# EAGLE design main (EAGLE 9.6.2)
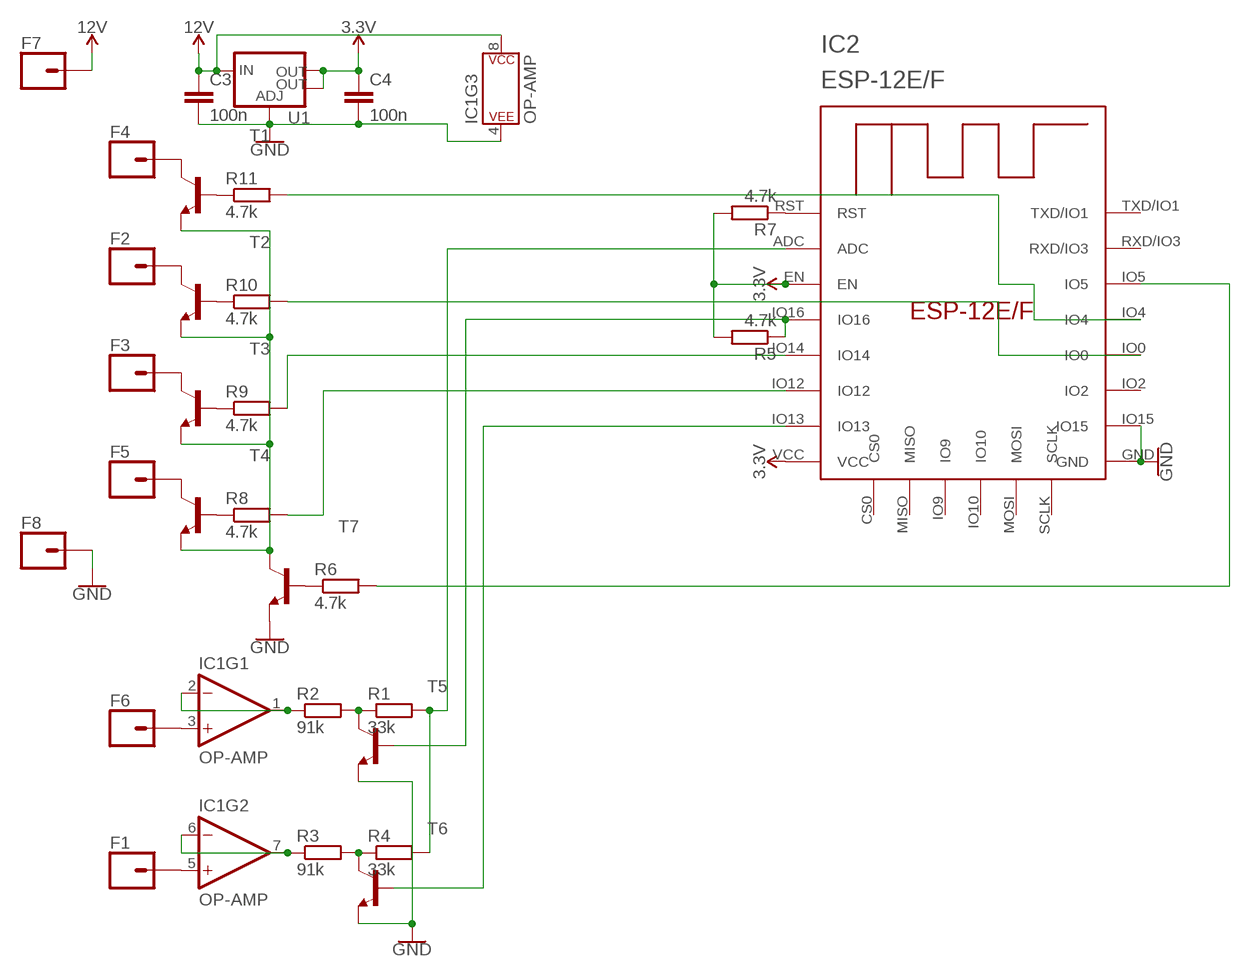
[diagram p0: schematic, sheet 1]

## Parts
C3  100n  C-EUC0805K  [C0805K]
C4  100n  C-EUC0805K  [C0805K]
F1  CONN_01OFFSET  [1X01_OFFSET]
F2  CONN_01OFFSET  [1X01_OFFSET]
F3  CONN_01OFFSET  [1X01_OFFSET]
F4  CONN_01OFFSET  [1X01_OFFSET]
F5  CONN_01OFFSET  [1X01_OFFSET]
F6  CONN_01OFFSET  [1X01_OFFSET]
F7  CONN_01OFFSET  [1X01_OFFSET]
F8  CONN_01OFFSET  [1X01_OFFSET]
IC1  OP-AMP  OPAMP-DUALU  [SO08]
IC2  ESP-12E/F  [ESP-12E]
R1  33k  R-EU_R0805  [R0805]
R2  91k  R-EU_R0805  [R0805]
R3  91k  R-EU_R0805  [R0805]
R4  33k  R-EU_R0805  [R0805]
R5  4.7k  R-EU_R0805  [R0805]
R6  4.7k  R-EU_R0805  [R0805]
R7  4.7k  R-EU_R0805  [R0805]
R8  4.7k  R-EU_R0805  [R0805]
R9  4.7k  R-EU_R0805  [R0805]
R10  4.7k  R-EU_R0805  [R0805]
R11  4.7k  R-EU_R0805  [R0805]
T1  MMBT5551LT1-NPN-SOT23-BEC  [SOT23-BEC]
T2  MMBT5551LT1-NPN-SOT23-BEC  [SOT23-BEC]
T3  MMBT5551LT1-NPN-SOT23-BEC  [SOT23-BEC]
T4  MMBT5551LT1-NPN-SOT23-BEC  [SOT23-BEC]
T5  MMBT5551LT1-NPN-SOT23-BEC  [SOT23-BEC]
T6  MMBT5551LT1-NPN-SOT23-BEC  [SOT23-BEC]
T7  MMBT5551LT1-NPN-SOT23-BEC  [SOT23-BEC]
U1  V_REG_LM1117SOT223  [SOT223]

## Nets
3.3V: C4.1 IC2.EN IC2.VCC R5.2 R7.2 U1.2(OUT) U1.4(OUT)
12V: C3.1 F7.1 IC1.8(P$V+) U1.3(IN)
GND: C3.2 C4.2 F8.1 IC1.4(P$V-) IC2.GND IC2.IO15 T5.E T6.E T7.E U1.1(ADJ)
N$1: F1.1 IC1.5(+IN)
N$2: F4.1 T1.C
N$3: F2.1 T2.C
N$4: F5.1 T4.C
N$5: F3.1 T3.C
N$6: F6.1 IC1.3(+IN)
N$7: T1.E T2.E T3.E T4.E T7.C
N$8: R6.1 T7.B
N$9: IC2.IO0 R10.2
N$10: R1.1 R2.2 T5.C
N$11: IC1.1(OUT) IC1.2(-IN) R2.1
N$12: R3.2 R4.1 T6.C
N$13: IC1.6(-IN) IC1.7(OUT) R3.1
N$14: IC2.ADC R1.2 R4.2
N$15: IC2.IO4 R11.2
N$16: IC2.IO5 R6.2
N$17: R8.1 T4.B
N$18: IC2.IO12 R8.2
N$19: IC2.IO13 T6.B
N$20: IC2.IO16 R5.1 T5.B
N$21: IC2.RST R7.1
N$25: R9.1 T3.B
N$26: R10.1 T2.B
N$27: R11.1 T1.B
N$28: IC2.IO14 R9.2
Unconnected: IC2.CS0 IC2.IO2 IC2.IO9 IC2.IO10 IC2.MISO IC2.MOSI IC2.RXD/IO3 IC2.SCLK IC2.TXD/IO1

## Library data of the parts
C3 C4 = resistor:C-EU: CAPACITOR, European symbol
F1-F8 = SparkFun-Connectors:CONN_01: Single connection point. Often used as Generic Header-pin footprint for 0.1 inch spaced/style header connections On any of the 0.1 inch spaced packages, you can populate with these: Break Away Headers - Straight <https://www.sparkfun.com/products/116> (PRT-00116) Break Away Male Headers - Right Angle <https://www.sparkfun.com/products/553> (PRT-00553) Female Headers <https://www.sparkfun.com/products/115> (PRT-00115) Break Away Headers - Machine Pin <https://www.sparkfun.com/products/117> (PRT-00117) Break Away Female Headers - Swiss Machine Pin <https://www.sparkfun.com/products/743> (PRT-00743) This device is also useful as a general connection point to wire up your design to another part of your project. Our various solder wires solder well into these plated through hole pads. Hook-Up Wire - Assortment (Stranded, 22 AWG) <https://www.sparkfun.com/products/11375> (PRT-11375) Hook-Up Wire - Assortment (Solid Core, 22 AWG) <https://www.sparkfun.com/products/11367> (PRT-11367) View the entire wire category on our website here <https://www.sparkfun.com/categories/141> Special notes: SMTSO-256-ET is a "flush mount" nut for a 4-40 screw. We mostly use this on specialty testbeds; it is a nice way to connect hardware to your PCB at an adjustable hieght. Also note, the SNAP packages are for using a snappable style connector. We sell a baggie of snaps and they are also used on two LilyPad designs: Snap Assortment - 30 pack (male and female) <https://www.sparkfun.com/products/11347> (DEV-11347) LilyPad Arduino SimpleSnap <https://www.sparkfun.com/products/10941> (DEV-10941) LilyPad SimpleSnap Protoboard <https://www.sparkfun.com/products/10940> (DEV-10940)
IC1 = SparkFun-IC-Amplifiers:OPAMP-DUAL: Generic op-amp footprint This component is for the standard 358 pinning of a dual op-amp From the LM358 datasheet: Pin 1: Output A Pin 2: Inverting Input A Pin 3: Non-Inverting Input A Pin 4: Gnd Pin 5: Non-Inverting Input B Pin 6: Inverting Input B Pin 7: Output B Pin 8: V+; PROD_ID: NA-XXXXX
IC2 = esp-12e-f:ESP-12E/F
R1-R11 = resistor:R-EU_: RESISTOR, European symbol
T1-T7 = transistor:*-NPN-: NPN Transistror BF959 corrected 2008.03.06
U1 = SparkFun-IC-Power:V_REG_LM1117: Voltage Regulator LM1117 Standard adjustable voltage regulator but in SMD form. Spark Fun Electronics SKU : COM-00595; PROD_ID: VREG-08170

## Board
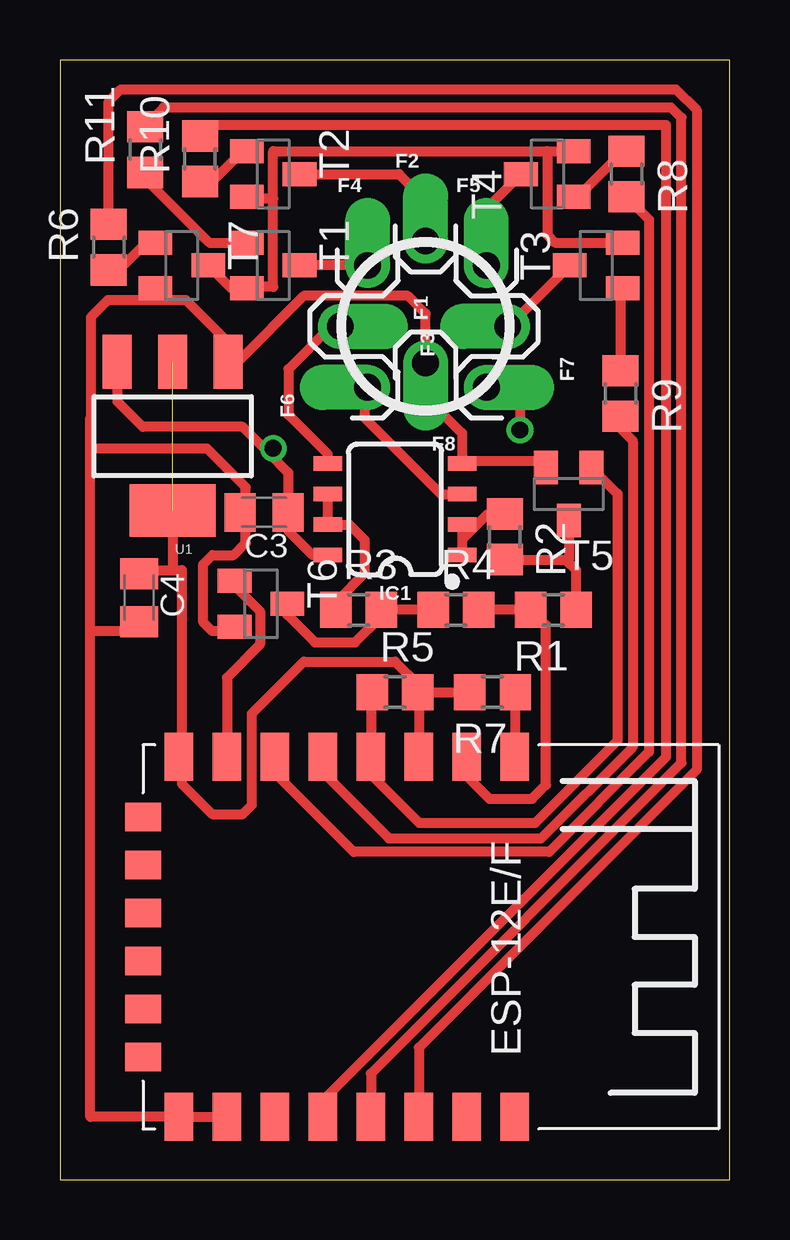
[diagram p1: board, top side]
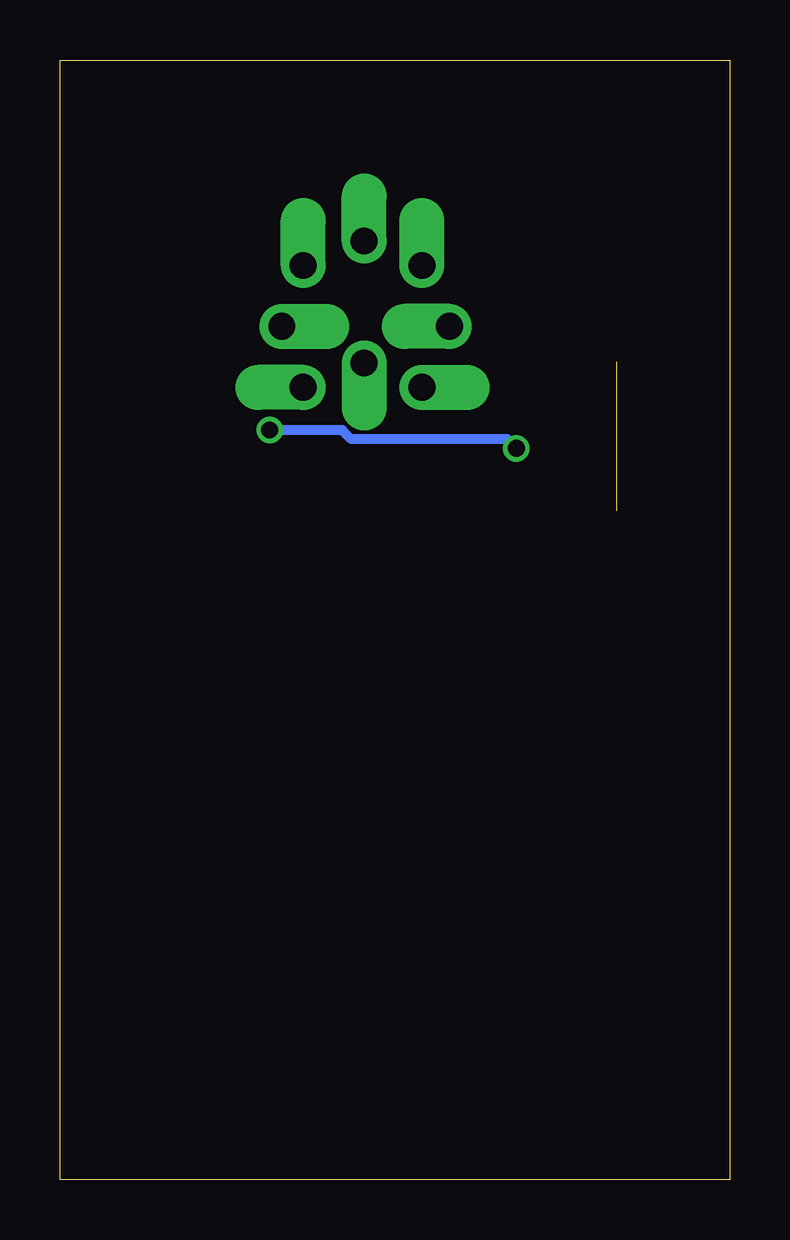
[diagram p2: board, bottom side, seen from below]

Size 27.92 x 46.66 mm. Coordinates in mm from the lower left corner, seen from the top.
Outline: 0,0 27.92,0 27.92,46.66 0,46.66 0,0
Copper layers (1*16): Top 0.035mm / dielectric 1.5mm / Bottom 0.035mm
Design rules "default": minimum track width 6mil, minimum drill 0.35mm, track to track 6mil, track to pad 6mil, pad to pad 6mil, via to via 6mil, smd to smd 6mil, copper to edge 40mil, drill to drill 6mil, minimum pad ring 10mil, minimum via ring 8mil, stop-mask expansion 4mil, vias tented up to drill 0mil, thermal gap 10mil

### Footprints (pad centres in the part's own frame; a part is rotated, then mirrored left to right if it is on the bottom)
C0805K = smd 1.3 x 1.6: 1 -1,0; 2 1,0
1X01_OFFSET = drill 1.118 pad 1.88 offset: 1 0,0
SO08 = smd 0.6 x 1.2: 1 -1.905,-2.8; 2 -0.635,-2.8; 3 0.635,-2.8; 4 1.905,-2.8; 5 1.905,2.8; 6 0.635,2.8; 7 -0.635,2.8; 8 -1.905,2.8
ESP-12E = smd 2 x 1.2: ADC -7.46,5.53; EN -7.46,3.53; GND 7.54,-6.47; IO0 7.54,-0.47; IO2 7.54,-2.47; IO4 7.54,1.53; IO5 7.54,3.53; IO12 -7.46,-2.47; IO13 -7.46,-4.47; IO14 -7.46,-0.47; IO15 7.54,-4.47; IO16 -7.46,1.53; RST -7.46,7.53; RXD/IO3 7.54,5.53; TXD/IO1 7.54,7.53; VCC -7.46,-6.47 | smd 1.2 x 1.5: CS0 -4.96,-7.97; IO9 -0.96,-7.97; IO10 1.04,-7.97; MISO -2.96,-7.97; MOSI 3.04,-7.97; SCLK 5.04,-7.97
R0805 = smd 1.3 x 1.5: 1 -0.95,0; 2 0.95,0
SOT23-BEC = smd 1 x 1.4: B -0.95,-1.1; C 0,1.1; E 0.95,-1.1
SOT223 = smd 1.219 x 2.235: 1 -2.311,-3.099; 2 0,-3.099; 3 2.311,-3.099 | smd 3.6 x 2.2: 4 0,3.099

### Placement (x,y rotation side)
C3  8.51,27.81 180 top
C4  3.3,24.26 270 top
F1  11.68,35.56 270 top
F2  15.24,39.12 0 top
F3  18.67,35.56 90 top
F4  12.83,38.1 0 top
F5  17.78,38.1 0 top
F6  12.83,33.02 90 top
F7  17.78,33.02 270 top
F8  15.24,34.04 180 top
IC1  13.97,27.94 90 top
IC2  11.43,10.16 270 top
R1  20.57,23.75 180 top
R2  18.54,26.8 270 top
R3  12.45,23.75 0 top
R4  16.51,23.75 0 top
R5  13.97,20.32 0 top
R6  2.03,38.86 90 top
R7  18.03,20.32 180 top
R8  23.62,41.91 270 top
R9  23.37,32.77 270 top
R10  5.84,42.54 90 top
R11  3.56,42.93 90 top
T1  8.89,38.1 270 top
T2  8.89,41.91 270 top
T3  22.35,38.1 90 top
T4  20.32,41.91 90 top
T5  21.21,28.57 180 top
T6  8.38,24 270 top
T7  5.08,38.1 270 top
U1  4.7,30.99 180 top

### Tracks (layer width: path | path; a pad name or v marks a point on that pad's centre or on a via)
3.3V  (1 unrouted)
  Top 0.406: 3.48,27.89 U1.4 4.7,25.4 | C4.1 3.44,25.4 4.7,25.4 | 4.7,25.4 5.08,25.4 5.08,17.74 IC2.VCC 5.08,17.5 5.08,16.51 6.35,15.24 7.62,15.24 8,15.62 8,19.43 10.16,21.59 13.97,21.59 14.96,20.6 14.96,20.36 | 14.96,20.36 IC2.EN | 14.96,20.36 R5.2 R7.2
12V  (via drill 0.7)
  Top 0.406: U1.3 2.39,32.44 3.45,31.37 7.62,31.37 8.7,30.29 | 9.52,27.94 9.52,27.05 10.54,26.04 IC1.8 | C3.1 9.51,27.93 9.52,27.94 | 8.7,30.29 9.52,29.47 9.52,27.94 | F7.1 19.05,33.02 19.18,32.89 v19.18,31.24 | v8.89,30.48 8.7,30.29
  Bottom 0.406: v19.18,31.24 16.16,31.24 15.78,30.86 9.27,30.86 v8.89,30.48
GND
  Top 0.406: 1.29,31.75 1.29,35.94 2,36.65 3.48,36.65 | 1.29,31.75 1.29,30.48 6.12,30.48 7.75,28.85 7.75,27.94 | 1.29,31.75 1.27,31.75 1.27,22.86 | 1.27,22.86 1.27,2.62 IC2.GND IC2.IO15 | T6.E 7.09,22.86 6.35,22.86 5.97,23.24 5.97,25.65 6.35,26.04 7.24,26.04 7.75,26.54 7.75,27.94 | C4.2 2.9,22.86 1.27,22.86 | T5.E 19.96,29.97 16.9,29.97 IC1.4 16.77,31.11 15.24,32.64 F8.1 15.24,36.1 14.51,36.83 10.16,36.83 7.42,34.09 U1.1 7.01,34.9 5.26,36.65 3.48,36.65 | C3.2 7.64,27.94 7.75,27.94 | T7.E 3.48,36.65
N$1
  Top 0.406: F1.1 11.3,35.56 9.53,33.78 9.53,31.88 11.17,30.23 IC1.5
N$2
  Top 0.406: F4.1 T1.C
N$3
  Top 0.406: T2.C 14.14,41.91 15.24,40.81 F2.1
N$4
  Top 0.406: T4.C 17.78,40.47 F5.1
N$5
  Top 0.406: T3.C 18.78,35.62 F3.1
N$6
  Top 0.406: F6.1 12.7,32.89 12.7,31.75 15.88,28.57 IC1.3
N$7
  Top 0.406: T2.E 7.86,40.89 8.89,40.89 | 8.89,40.89 8.89,37.21 7.85,37.21 T1.E 7.13,37.15 T7.C | 8.89,40.89 8.89,42.86 20.32,42.86 | 20.32,42.86 T4.E | 20.32,42.86 20.32,39.37 20.64,39.05 T3.E
N$8
  Top 0.406: R6.1 2.03,38.17 2.72,38.17 3.6,39.05 T7.B
N$9
  Top 0.406: IC2.IO0 10.96,3.31 25.27,17.62 25.27,43.94 6.29,43.94 R10.2
N$10
  Top 0.406: 18.9,26.21 R2.2 21.08,25.85 | R1.1 21.52,25.41 21.08,25.85 | 21.08,25.85 21.21,25.85 T5.C
N$11
  Top 0.406: IC1.2 16.77,26.67 | 16.77,26.67 IC1.1 | R2.1 17.85,27.75 16.77,26.67
N$12
  Top 0.406: R4.1 R3.2 13.36,23.44 12.31,22.39 10.63,22.39 9.48,23.54 T6.C
N$13
  Top 0.406: IC1.6 IC1.7 12.06,27.3 12.7,26.67 12.7,25.27 11.56,24.13 11.43,24.13 11.43,23.82 R3.1
N$14
  Top 0.406: R4.2 R1.2 20.26,23.11 20.26,16.45 19.68,15.88 17.91,15.88 16.96,16.82 IC2.ADC
N$15
  Top 0.406: IC2.IO4 12.96,4.42 25.91,17.37 25.91,44.26 25.49,44.68 4.32,44.68 3.56,43.92 R11.2
N$16
  Top 0.406: R6.2 2.03,44.93 2.54,45.44 25.68,45.44 26.54,44.58 26.54,17.09 14.96,5.51 IC2.IO5
N$17
  Top 0.406: R8.1 23.5,42.86 21.59,40.96 T4.B
N$18
  Top 0.406: R8.2 24.56,40.02 24.56,17.83 20.4,13.67 12.24,13.67 8.89,17.02 8.89,17.55 IC2.IO12
N$19
  Top 0.406: T6.B 7.28,24.76 8.34,23.7 8.34,22.31 6.96,20.93 IC2.IO13
N$20
  Top 0.406: T5.B 23.24,28.59 23.24,18.29 19.81,14.86 14.99,14.86 12.96,16.89 IC2.IO16 12.96,20.26 R5.1
N$21
  Top 0.406: R7.1 18.96,20.3 IC2.RST
N$25
  Top 0.406: R9.1 23.37,37.07 T3.B
N$26
  Top 0.406: R10.1 6.35,41.59 7.62,42.86 T2.B
N$27
  Top 0.406: R11.1 3.56,41.72 6.23,39.05 T1.B
N$28
  Top 0.406: R9.2 23.37,31.31 23.88,30.8 23.88,18.03 20.07,14.22 13.72,14.22 10.96,16.98 IC2.IO14